# EAGLE design dnc_ext_info_bouton (EAGLE 7.1.0)
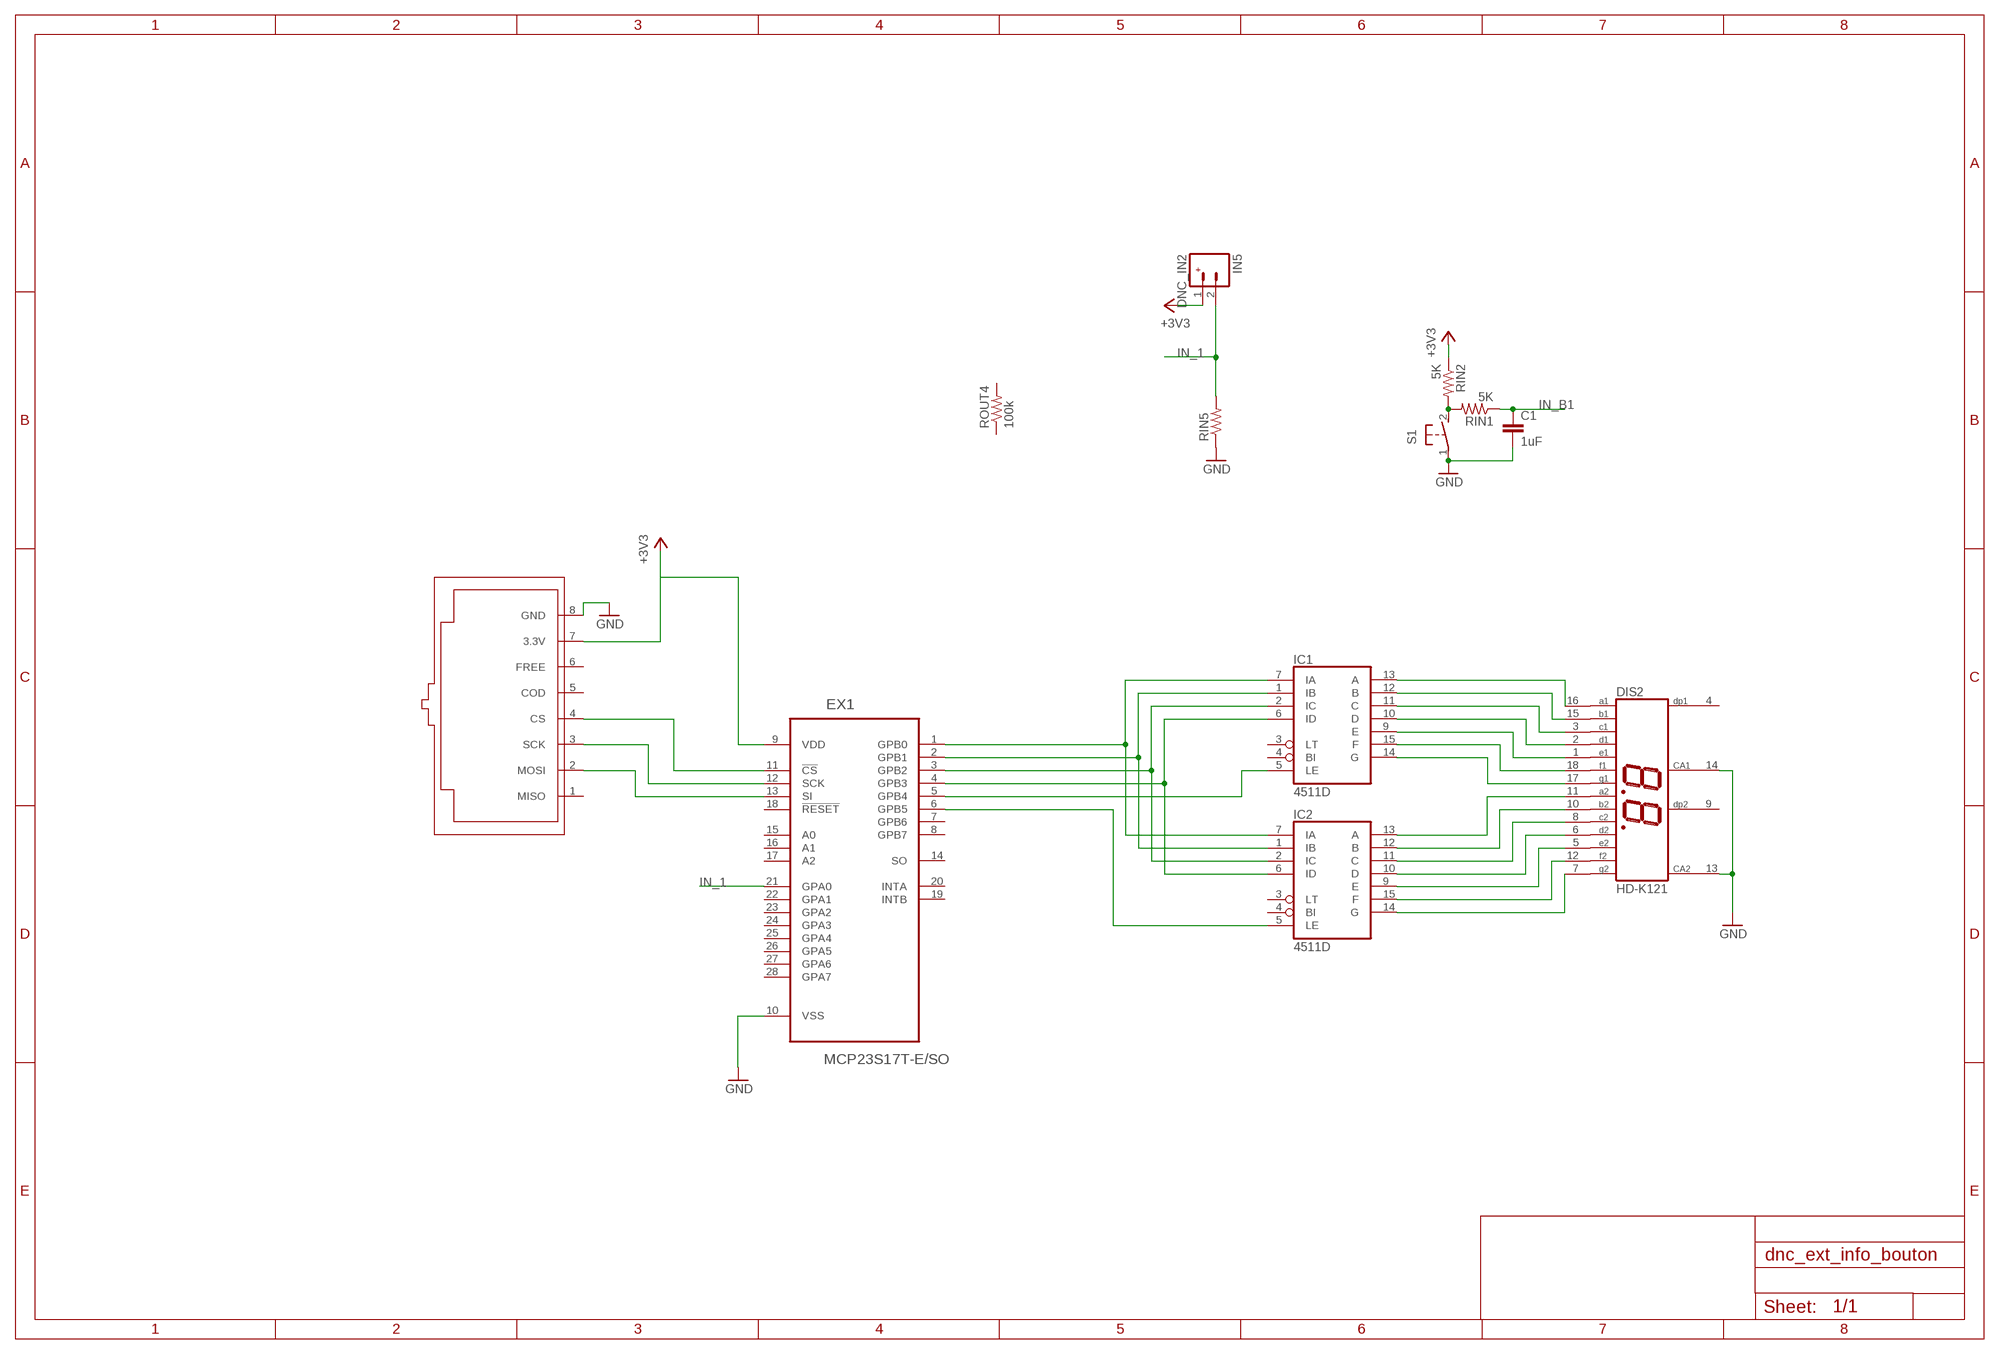
[diagram p0: schematic, sheet 1]

## Parts
C1  1uF  CAP0603-CAP  [0603-CAP]
DIS2  HD-K121  [HDSP-R]
EX1  MCP23S17T-E/SO  [SOIC127P1030X265-28N]
IC1  4511D  [SO16]
IC2  4511D  [SO16]
IN5  DNC_IN2  [DNC_IN2]
RIN1  5K  RESISTOR0603-RES  [0603-RES]
RIN2  5K  RESISTOR0603-RES  [0603-RES]
RIN5  RESISTOR0603-RES  [0603-RES]
ROUT4  100k  RESISTOR0603-RES  [0603-RES]
S1  31-XX  [B3F-31XX]
U$6  RJ45-EXTDNC  [RJ45-TRAFO]

## Nets
+3V3: EX1.9(VDD) IN5.1 RIN2.1 U$6.7(3.3V)
GND: C1.2 DIS2.13(CA2) DIS2.14(CA1) EX1.10(VSS) RIN5.1 S1.1(P) U$6.8(GND)
IN_1: EX1.21(GPA0) IN5.2 RIN5.2
IN_B1: C1.1 RIN1.1
N$1: RIN1.2 RIN2.2 S1.2(S)
N$13: EX1.11(!CS) U$6.4(CS)
N$14: EX1.12(SCK) U$6.3(SCK)
N$15: EX1.13(SI) U$6.2(MOSI)
N$16: EX1.1(GPB0) IC1.7(IA) IC2.7(IA)
N$17: EX1.2(GPB1) IC1.1(IB) IC2.1(IB)
N$18: EX1.3(GPB2) IC1.2(IC) IC2.2(IC)
N$19: EX1.4(GPB3) IC1.6(ID) IC2.6(ID)
N$20: EX1.5(GPB4) IC1.5(LE)
N$22: EX1.6(GPB5) IC2.5(LE)
N$23: DIS2.16(A1) IC1.13(A)
N$24: DIS2.15(B1) IC1.12(B)
N$25: DIS2.3(C1) IC1.11(C)
N$26: DIS2.2(D1) IC1.10(D)
N$27: DIS2.1(E1) IC1.9(E)
N$28: DIS2.18(F1) IC1.15(F)
N$29: DIS2.17(G1) IC1.14(G)
N$30: DIS2.11(A2) IC2.13(A)
N$31: DIS2.10(B2) IC2.12(B)
N$32: DIS2.8(C2) IC2.11(C)
N$33: DIS2.6(D2) IC2.10(D)
N$34: DIS2.5(E2) IC2.9(E)
N$35: DIS2.12(F2) IC2.15(F)
N$36: DIS2.7(G2) IC2.14(G)
Unconnected: DIS2.4(DP1) DIS2.9(DP2) EX1.7(GPB6) EX1.8(GPB7) EX1.14(SO) EX1.15(A0) EX1.16(A1) EX1.17(A2) EX1.18(!RESET) EX1.19(INTB) EX1.20(INTA) EX1.22(GPA1) EX1.23(GPA2) EX1.24(GPA3) EX1.25(GPA4) EX1.26(GPA5) EX1.27(GPA6) EX1.28(GPA7) IC1.3(LT) IC1.4(BI) IC2.3(LT) IC2.4(BI) ROUT4.1 ROUT4.2 U$6.1(MISO) U$6.5(COD) U$6.6(FREE)

## Power pins joined to a net without a drawn wire
VDD: IC1.16(VDD) IC2.16(VDD)
VSS: IC1.8(VSS) IC2.8(VSS)

## Library data of the parts
C1 = SparkFun:CAP: Capacitor Standard 0603 ceramic capacitor, and 0.1" leaded capacitor.
DIS2 = display-hp:HD-K121: LED DISPLAY 2 x 1 character 7 segment, decimal points right; OC_FARNELL: unknown; OC_NEWARK: unknown
EX1 = pierre_vv:MCP23S17T-E/SO: 16-Bit I/O Expander,SOIC-28; MPN: MCP23S17T-E/SO; OC_FARNELL: 2101293; OC_NEWARK: 31K2954; PACKAGE: SOIC-28; SUPPLIER: MICROCHIP
IC1 IC2 = 45xx:4511: BCD to 7-segment LATCH/DECODER/DRIVER
IN5 = pierre_vv:DNC_IN2
RIN1 RIN2 RIN5 ROUT4 = SparkFun-Passives:RESISTOR: Resistor Basic schematic elements and footprints for 0603, 1206, and PTH resistors.
S1 = switch-omron:31-XX: OMRON SWITCH; MPN: B3F-3100; OC_FARNELL: 959704; OC_NEWARK: 36M3582
U$6 = con-amphenol-rj45-ld:RJ45-EXTDNC: dnc

## Net classes
0 default: width 0.203 mm
1 GND: width 0.254 mm
2 3.3V: width 0.254 mm

## Board
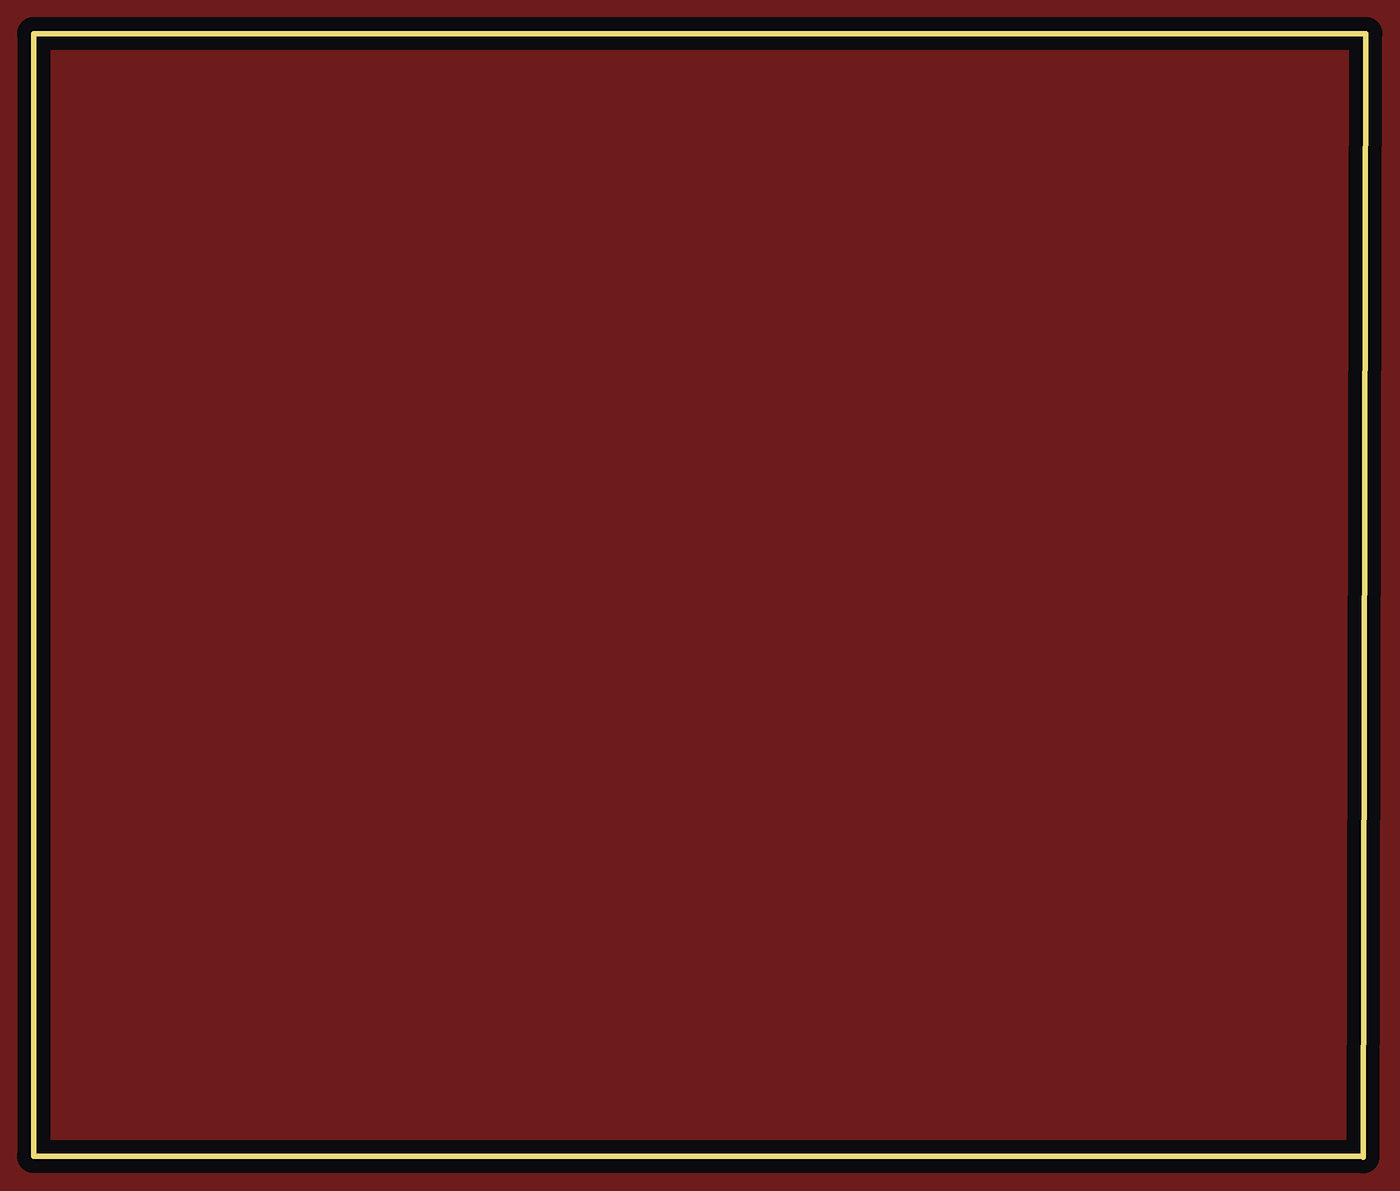
[diagram p1: board, top side]
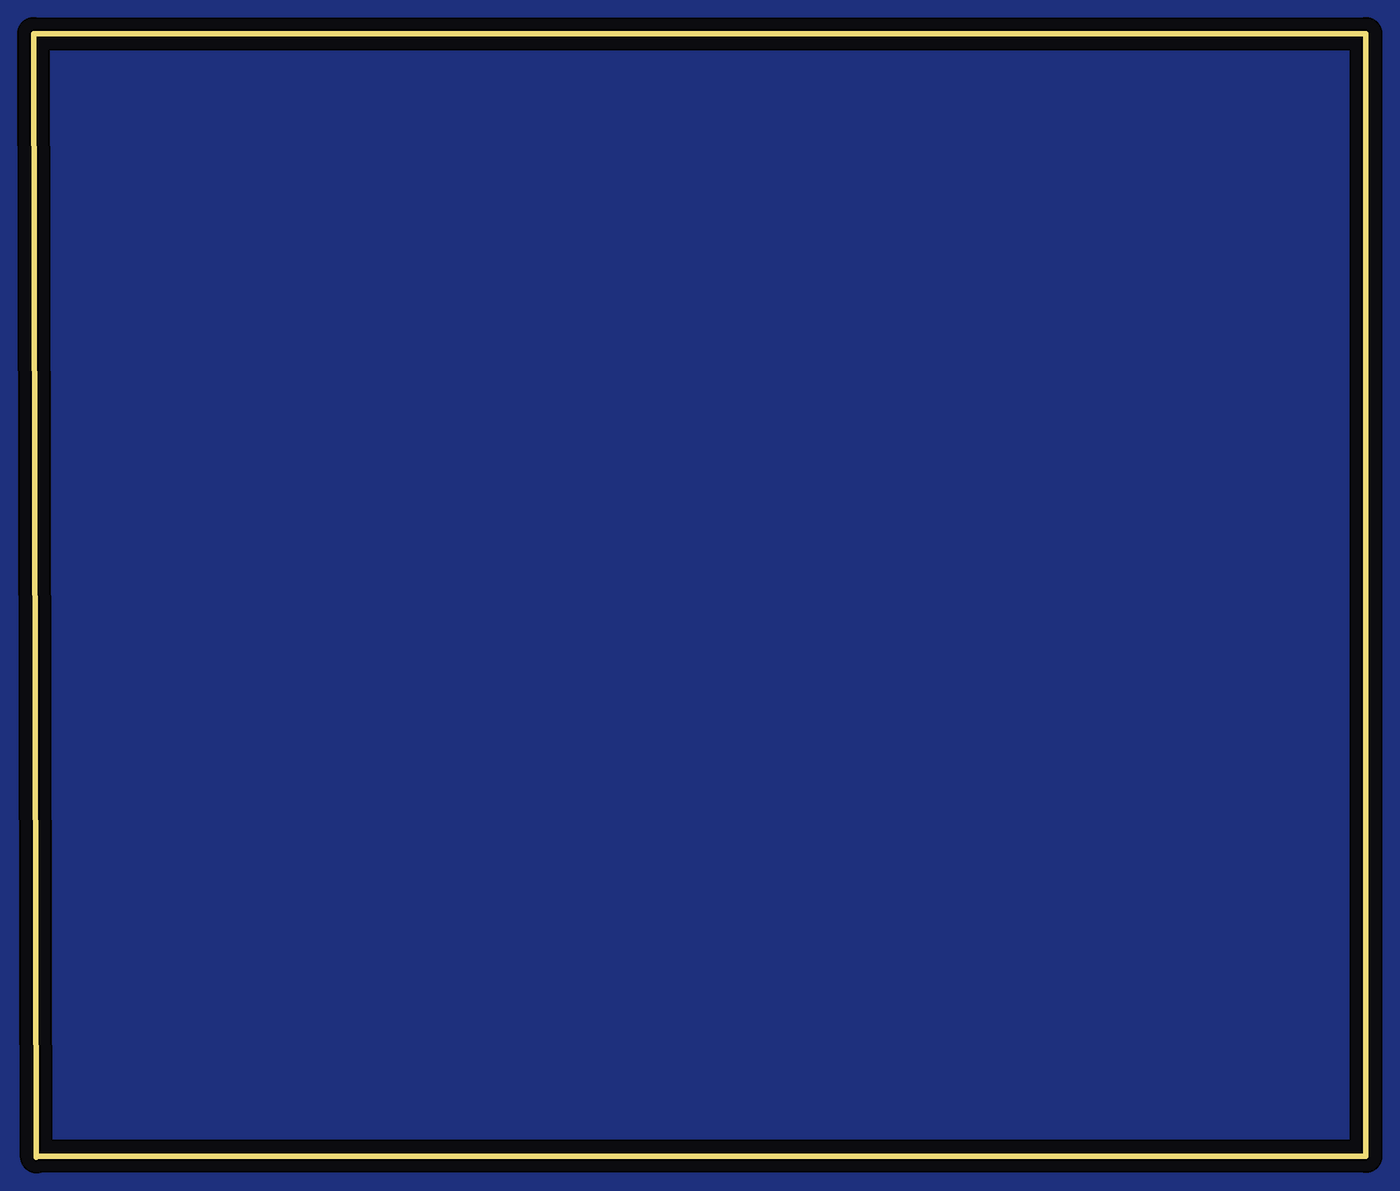
[diagram p2: board, bottom side, seen from below]

Size 98.74 x 83.25 mm. Coordinates in mm from the lower left corner, seen from the top.
Outline: 98.41,0.06 0,0.06 0,83.25 98.74,83.25 98.55,0
Copper layers (1*16): Top 0.035mm / dielectric 1.5mm / Bottom 0.035mm
Design rules "default": minimum track width 10mil, minimum drill 24mil, track to track 8mil, track to pad 8mil, pad to pad 8mil, via to via 8mil, smd to smd 8mil, copper to edge 40mil, drill to drill 8mil, minimum pad ring 10mil, minimum via ring 8mil, stop-mask expansion 4mil, vias tented up to drill 0mil, thermal gap 10mil

### Footprints (pad centres in the part's own frame; a part is rotated, then mirrored left to right if it is on the bottom)
0603-CAP = smd 1.1 x 1: 1 -0.85,0; 2 0.85,0
HDSP-R = drill 0.813 long: 1 -10.16,-7.62; 2 -7.62,-7.62; 3 -5.08,-7.62; 4 -2.54,-7.62; 5 0,-7.62; 6 2.54,-7.62; 7 5.08,-7.62; 8 7.62,-7.62; 9 10.16,-7.62; 10 10.16,7.62; 11 7.62,7.62; 12 5.08,7.62; 13 2.54,7.62; 14 0,7.62; 15 -2.54,7.62; 16 -5.08,7.62; 17 -7.62,7.62; 18 -10.16,7.62
SOIC127P1030X265-28N = smd 1.981 x 0.559: 1 -4.521,8.255; 2 -4.521,6.985; 3 -4.521,5.715; 4 -4.521,4.445; 5 -4.521,3.175; 6 -4.521,1.905; 7 -4.521,0.635; 8 -4.521,-0.635; 9 -4.521,-1.905; 10 -4.521,-3.175; 11 -4.521,-4.445; 12 -4.521,-5.715; 13 -4.521,-6.985; 14 -4.521,-8.255; 15 4.521,-8.255; 16 4.521,-6.985; 17 4.521,-5.715; 18 4.521,-4.445; 19 4.521,-3.175; 20 4.521,-1.905; 21 4.521,-0.635; 22 4.521,0.635; 23 4.521,1.905; 24 4.521,3.175; 25 4.521,4.445; 26 4.521,5.715; 27 4.521,6.985; 28 4.521,8.255
SO16 = smd 0.66 x 2.032: 1 -4.445,-3.073; 2 -3.175,-3.073; 3 -1.905,-3.073; 4 -0.635,-3.073; 5 0.635,-3.073; 6 1.905,-3.073; 7 3.175,-3.073; 8 4.445,-3.073; 9 4.445,3.073; 10 3.175,3.073; 11 1.905,3.073; 12 0.635,3.073; 13 -0.635,3.073; 14 -1.905,3.073; 15 -3.175,3.073; 16 -4.445,3.073
DNC_IN2 = drill 1.016 long: 1 -0.127,0; 2 2.667,0
0603-RES = smd 1.1 x 1: 1 -0.85,0; 2 0.85,0
B3F-31XX = drill 1.016 offset: 1 -2.261,-1.245; 2 2.261,-1.245 | drill 1.499 pad 2.54: 3 -3.505,1.245; 4 3.505,1.245
RJ45-TRAFO = drill 0.9 offset: 1 -2.54,2.54; 2 -3.556,4.318; 3 -0.508,2.54; 4 -1.524,4.318; 5 1.524,2.54; 6 0.508,4.318; 7 3.556,2.54; 8 2.54,4.318 | hole 3.2: -6.35,0; 6.35,0

### Placement (x,y rotation side)
C1  -63.18,-105.03 0 top  (outside the outline)
DIS2  -41.91,-79.95 0 top  (outside the outline)
EX1  -48.9,-16.76 0 top  (outside the outline)
IC1  -47.94,-34.23 0 top  (outside the outline)
IC2  -47.94,-43.43 0 top  (outside the outline)
IN5  -52.7,-97.09 0 top  (outside the outline)
RIN1  -63.18,-108.2 0 top  (outside the outline)
RIN2  -63.18,-111.38 0 top  (outside the outline)
RIN5  -53.66,-102.49 0 top  (outside the outline)
ROUT4  -53.66,-92.01 0 top  (outside the outline)
S1  -60.01,-96.77 0 top  (outside the outline)
U$6  -34.29,-12.32 0 top  (outside the outline)

### Tracks (layer width: path | path; a pad name or v marks a point on that pad's centre or on a via)
+3V3  (3 unrouted)
GND  (6 unrouted)
  pour Top: -6.03,89.6 107.63,89.6 107.63,-3.75 -6.03,-3.75
  pour Bottom: -8.57,92.46 114.3,92.46 114.3,-14.54 -8.57,-14.54
IN_1  (2 unrouted)
IN_B1  (1 unrouted)
N$1  (2 unrouted)
N$13  (1 unrouted)
N$14  (1 unrouted)
N$15  (1 unrouted)
N$16  (2 unrouted)
N$17  (2 unrouted)
N$18  (2 unrouted)
N$19  (2 unrouted)
N$20  (1 unrouted)
N$22  (1 unrouted)
N$23  (1 unrouted)
N$24  (1 unrouted)
N$25  (1 unrouted)
N$26  (1 unrouted)
N$27  (1 unrouted)
N$28  (1 unrouted)
N$29  (1 unrouted)
N$30  (1 unrouted)
N$31  (1 unrouted)
N$32  (1 unrouted)
N$33  (1 unrouted)
N$34  (1 unrouted)
N$35  (1 unrouted)
N$36  (1 unrouted)
VDD  (1 unrouted)
VSS  (1 unrouted)